# Altium schematic sheet 2020年电赛校赛功率板.SchDoc
size A4; DocumentNumber: 1; Revision: V2.0; SheetNumber: 1; SheetTotal: 5
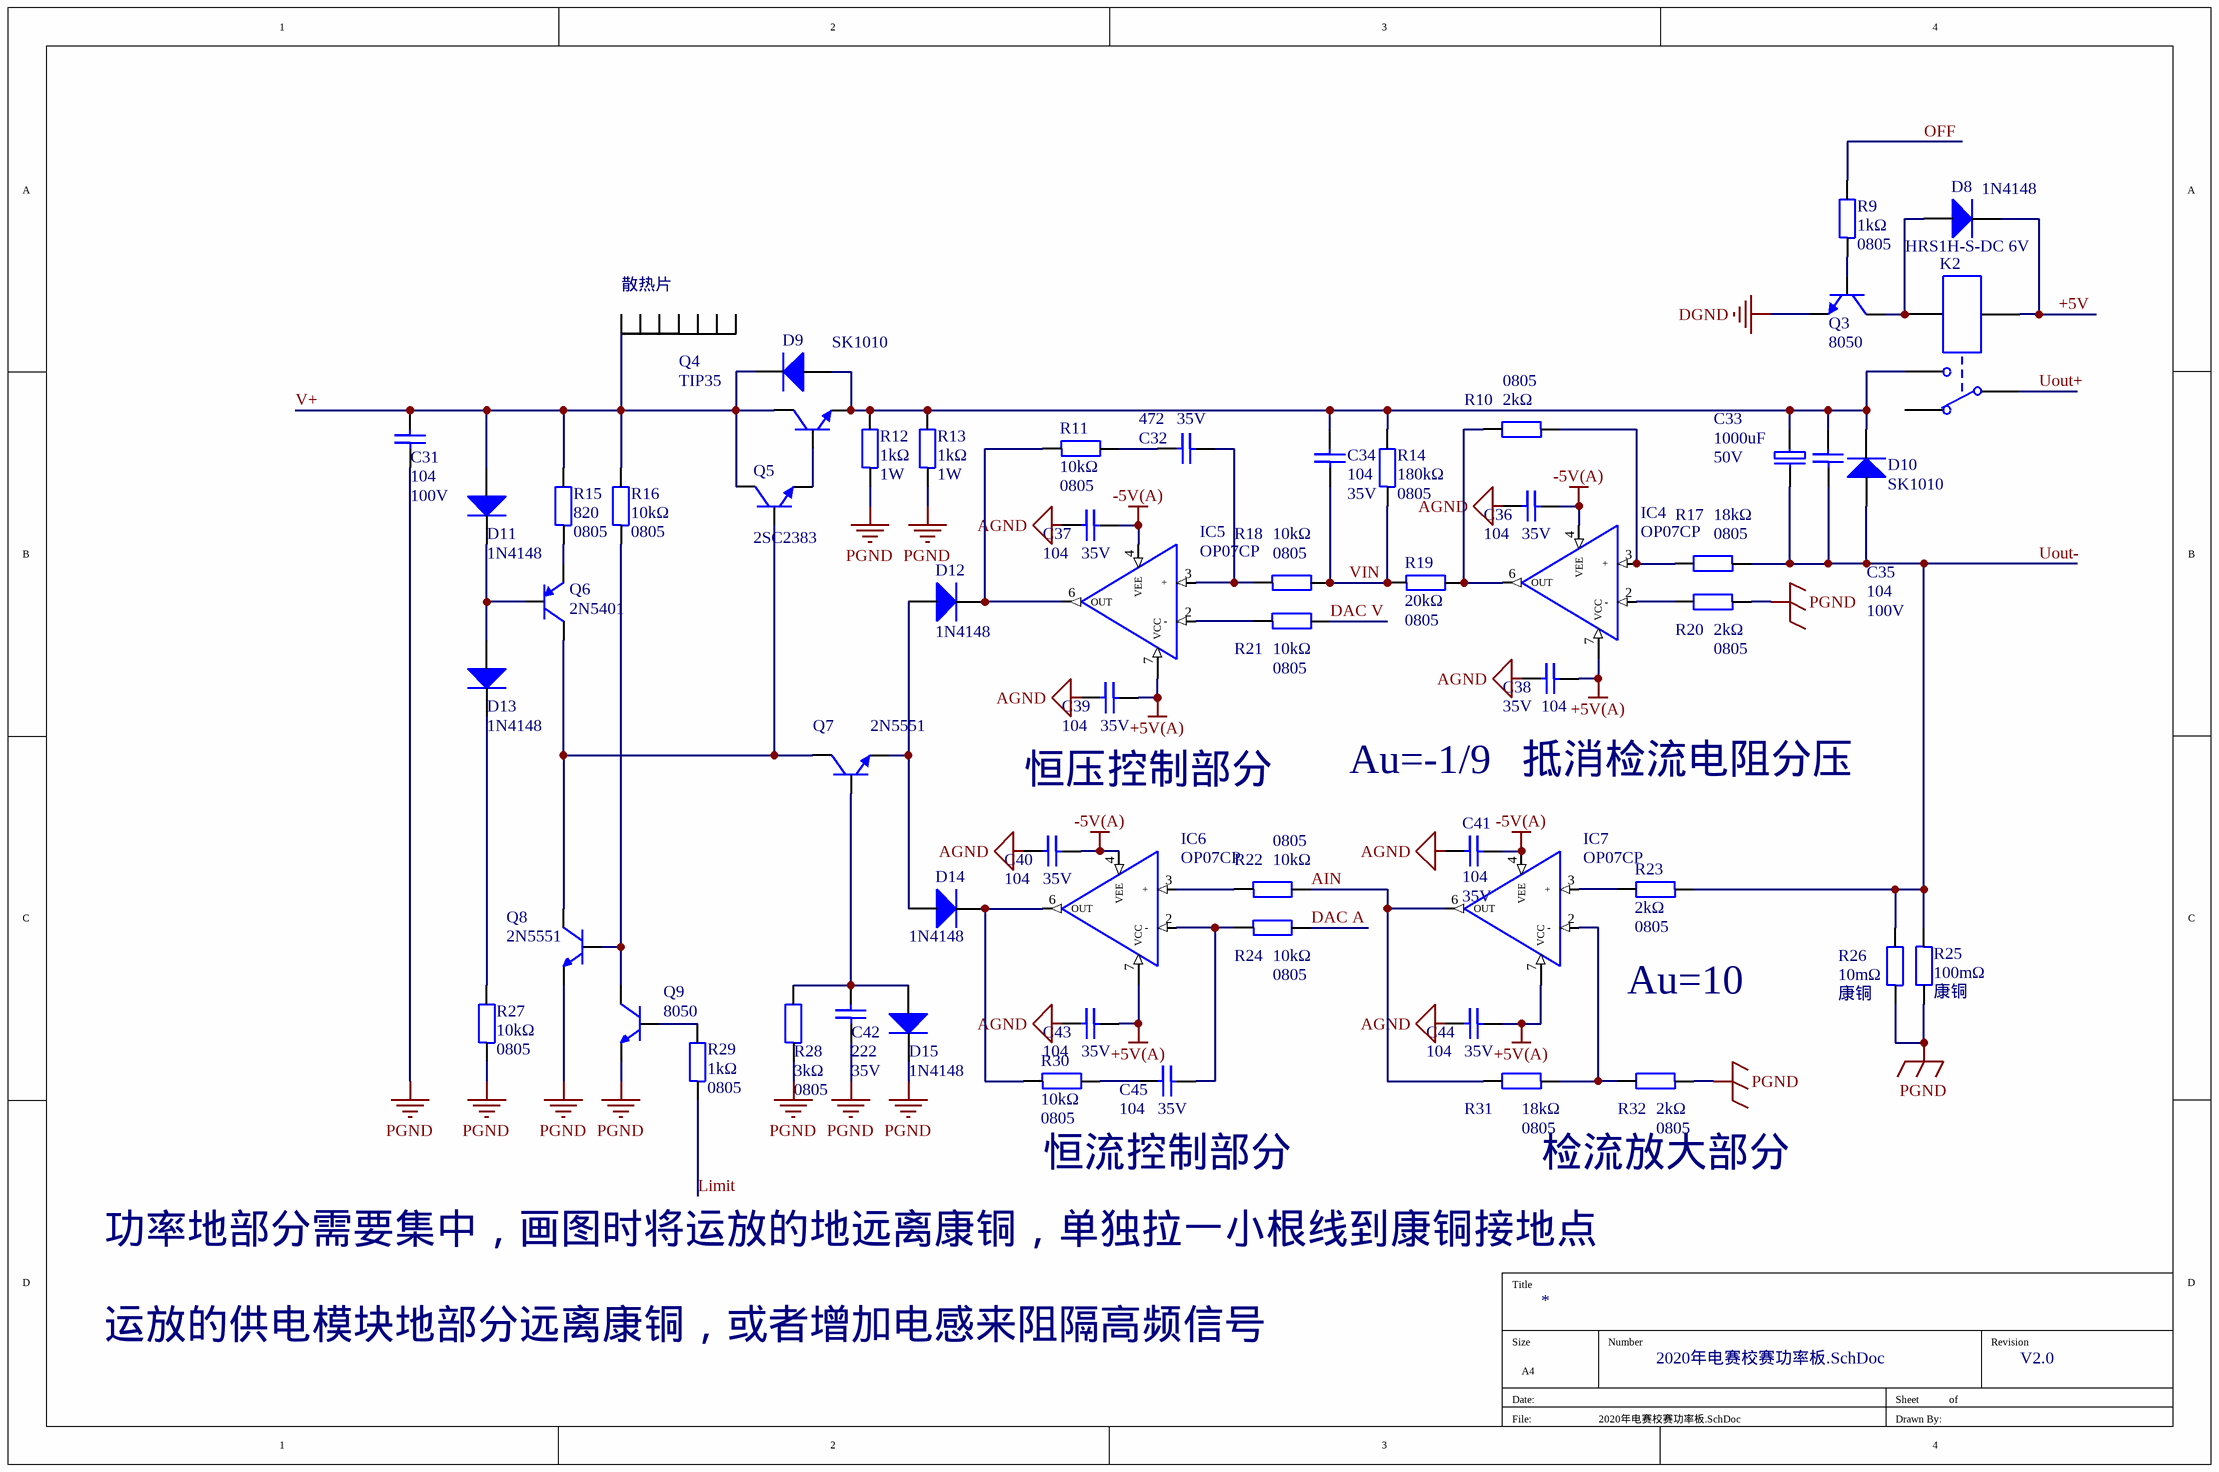
[diagram p0: 2020年电赛校赛功率板.SchDoc]

## Parts
C31  104  value 100V  [C0805]
C32  472  value 35V  [C0805]
C33  1000uF  value 50V  [50V 1000uF]
C34  104  value 35V  [C0805]
C35  104  value 100V  [C0805]
C36  104  value 35V  [C0805]
C37  104  value 35V  [C0805]
C38  104  value 35V  [C0805]
C39  104  value 35V  [C0805]
C40  104  value 35V  [C0805]
C41  104  value 35V  [C0805]
C42  222  value 35V  [C0805]
C43  104  value 35V  [C0805]
C44  104  value 35V  [C0805]
C45  104  value 35V  [C0805]
D8  1N4148  [LL34]
D9  SK1010  [SMC(DO-214AB)]
D10  SK1010  [SMC(DO-214AB)]
D11  1N4148  [LL34]
D12  1N4148  [LL34]
D13  1N4148  [LL34]
D14  1N4148  [LL34]
D15  1N4148  [LL34]
IC4  OP07CP  [SOP-8(体宽3.8mm)]
IC5  OP07CP  [SOP-8(体宽3.8mm)]
IC6  OP07CP  [SOP-8(体宽3.8mm)]
IC7  OP07CP  [SOP-8(体宽3.8mm)]
K2  HRS1H-S-DC 6V  [HRS1H-S-DC 6V]
Q3  8050  [SOT-23]
Q4  TIP35  [TO-247]
Q5  2SC2383  [TO-92]
Q6  2N5401  [SOT-23]
Q7  2N5551  [SOT-23]
Q8  2N5551  [SOT-23]
Q9  8050  [SOT-23]
R9  1kΩ  value 0805  [R0805]
R10  2kΩ  value 0805  [R0805]
R11  10kΩ  value 0805  [R0805]
R12  1kΩ  value 1W  [Res-1W]
R13  1kΩ  value 1W  [Res-1W]
R14  180kΩ  value 0805  [R0805]
R15  820  value 0805  [R0805]
R16  10kΩ  value 0805  [R0805]
R17  18kΩ  value 0805  [R0805]
R18  10kΩ  value 0805  [R0805]
R19  20kΩ  value 0805  [R0805]
R20  2kΩ  value 0805  [R0805]
R21  10kΩ  value 0805  [R0805]
R22  10kΩ  value 0805  [R0805]
R23  2kΩ  value 0805  [R0805]
R24  10kΩ  value 0805  [R0805]
R25  100mΩ  value 康铜  [100mΩ康铜]
R26  10mΩ  value 康铜  [10mΩ康铜]
R27  10kΩ  value 0805  [R0805]
R28  3kΩ  value 0805  [R0805]
R29  1kΩ  value 0805  [R0805]
R30  10kΩ  value 0805  [R0805]
R31  18kΩ  value 0805  [R0805]
R32  2kΩ  value 0805  [R0805]
S1  散热片  [散热片]  (value not drawn)

## Nets
+5V(A): C38.2 C39.2 C43.2 C44.2 IC4.7(VCC) IC5.7(VCC) IC6.7(VCC) IC7.7(VCC)
-5V(A): C36.2 C37.2 C40.2 C41.2 IC4.4(VEE) IC5.4(VEE) IC6.4(VEE) IC7.4(VEE)
AGND: C36.1 C37.1 C38.1 C39.1 C40.1 C41.1 C43.1 C44.1
DGND: Q3.2(E)
PGND: C31.1 C42.1 D15.2(K) Q8.2(E) Q9.2(E) R12.1 R13.1 R20.1 R25.2 R26.1 R27.1 R28.1 R32.1
+5V: D8.2(K) K2.2
AIN: IC7.6(OUT) R22.2 R31.2
DAC A: R24.2
DAC V: R21.2
Limit: R29.1
OFF: R9.2
Uout+: K2.4
Uout-: C33.2(-) C35.1 D10.1(A) R17.1 R23.1 R25.1 R26.2
V+: C31.2 D9.2(K) D11.1(A) Q4.2(C) Q5.2(C) R15.2 R16.2 S1.1
VIN: C34.1 R14.1 R18.2 R19.1
NetC32_1: C32.1 R11.2
NetC32_2: C32.2 IC5.3(+) R18.1
NetC33_1: C33.1(+) C34.2 C35.2 D9.1(A) D10.2(K) K2.6 Q4.3(E) R12.2 R13.2 R14.2
NetC42_2: C42.2 D15.1(A) Q7.1(B) R28.2
NetC45_1: C45.1 R30.2
NetC45_2: C45.2 IC6.2(-) R24.1
NetD8_1: D8.1(A) K2.5 Q3.3(C)
NetD11_2: D11.2(K) D13.1(A) Q6.1(B)
NetD12_1: D12.1(A) D14.1(A) Q7.2(E)
NetD12_2: D12.2(K) IC5.6(OUT) R11.1
NetD13_2: D13.2(K) R27.2
NetD14_2: D14.2(K) IC6.6(OUT) R30.1
NetIC4_2: IC4.2(-) R20.2
NetIC4_3: IC4.3(+) R10.1 R17.2
NetIC4_6: IC4.6(OUT) R10.2 R19.2
NetIC5_2: IC5.2(-) R21.1
NetIC6_3: IC6.3(+) R22.1
NetIC7_2: IC7.2(-) R31.1 R32.2
NetIC7_3: IC7.3(+) R23.2
NetQ3_1: Q3.1(B) R9.1
NetQ4_1: Q4.1(B) Q5.1(E)
NetQ5_3: Q5.3(B) Q6.3(C) Q7.3(C) Q8.3(C)
NetQ6_2: Q6.2(E) R15.1
NetQ8_1: Q8.1(B) Q9.3(C) R16.1
NetQ9_1: Q9.1(B) R29.2

Not connected (* = marked no-connect by the designer): K2 1; S1 2

## Notes on the sheet
- (near S1) 散热片
- 恒压控制部分
- Au=-1/9
- 抵消检流电阻分压
- Au=10
- 恒流控制部分
- 检流放大部分
- 功率地部分需要集中，画图时将运放的地远离康铜，单独拉一小根线到康铜接地点
- 运放的供电模块地部分远离康铜，或者增加电感来阻隔高频信号

## Library data of the parts
C31 C32 C34-C45 = 104: 无极性电容
C33 = 100uF: 有极性电容
D8-D15 = Diode: 二极管
IC4-IC7 = OP07CP: 运放
K2 = HRS1H-S-DC 6V: 继电器
Q3-Q5 Q7 = NPN: 三极管
Q6 = PNP
Q8 = NPN!
Q9 = NPN!: 三极管
R9-R32 = 10kΩ: 贴片/直插电阻